# Altium schematic sheet Flash.SchDoc
size A; SheetNumber: 12
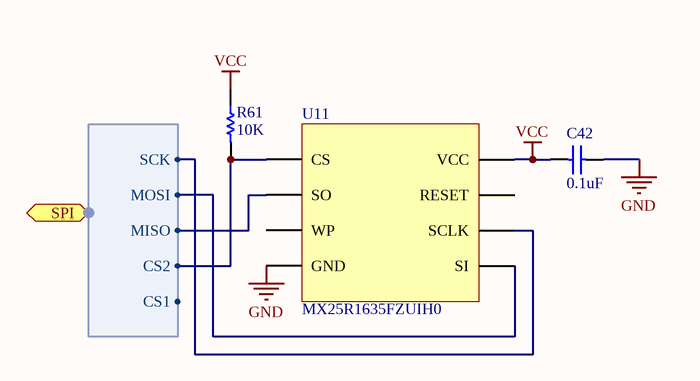
[diagram p0: Flash.SchDoc]

## Parts
C42  value 0.1uF  [C0402[1005X55]]  (hidden comment: 0.1uF 6.3V 0402)
R61  value 10K  [R0402[1005]]  (hidden comment: 10K 1% 0402)
U11  MX25R1635FZUIH0  [USON-8]

## Ports
SPI (harness SPI)

## Harnesses
SPI: SCK, MOSI, MISO, CS2, CS1

## Nets
GND: C42.2 U11.4(GND)
VCC: C42.1 R61.2 U11.8(VCC)
NetR61_1: R61.1 U11.1(CS) ; port SPI.CS2
NetU11_2: U11.2(SO) ; port SPI.MISO
NetU11_5: U11.5(SI) ; port SPI.MOSI
NetU11_6: U11.6(SCLK) ; port SPI.SCK

Not connected (* = marked no-connect by the designer): U11 3(WP) 7(RESET)

## Library data of the parts
C42 = CAP_0.1uF_6.3V_0402_10%: 0.1uF 6.3V 10% 0402 (1005 Metric); PartNumber: GRM155R70J104KA01D; Manufacturer: Murata; Mounting Technology: Surface Mount; PackageReference: 0402; PackageDescription: 0402 (1005 Metric); Voltage: 6.3V; Tolerance: 10%
R61 = RES_10K_0402_1%: 10K 0.063W 1% 0402 (1005 Metric); Manufacturer: KOA Speer; PartNumber: RK73H1ETTP1002F; Tolerance: 1%; Power: 0.063W; Mounting Technology: Surface Mount; PackageReference: 0402; PackageDescription: 0402 (1005 Metric); ComponentLink1Description: Datasheet; ComponentLink1URL: http://www.koaspeer.com/catimages/Products/RK73H/RK73H.pdf
U11 = MX25R1635FZUIH0: pin to pad: 4>4+9; Manufacturer: Macronix; PartNumber: MX25R1635FZUIH0; Mounting Technology: Surface Mount; PackageReference: USON-8